# Altium schematic sheet PIJIAKUN_BF83080C_V1.0-260104-共阳_20260721.schdoc
size 297 x 209 mm; Symbol: Drawing-Symbol_A4; Company: 嘉立创EDA; Version: V1.0; Page Size: A4; @Project Name: 20270715_PIJIAKUN; @Update Date: 2026-07-20; @Create Date: 2026-07-20; Device: Drawing-Symbol_A4; @Board Name: Board3; @Page Name: P1; @Create Time: 16:21:44; @Page Count: 1; @Page No: 1; @Schematic Name: Schematic2; @Update Time: 16:21:44; @Assembly Variant: Basic; Border: 1; Title Block Position: 3; Size: A4; Width: 1170; Height: 825; Region Start: 1; X Region Count: 6; Y Region Count: 4; Blade Width: 10
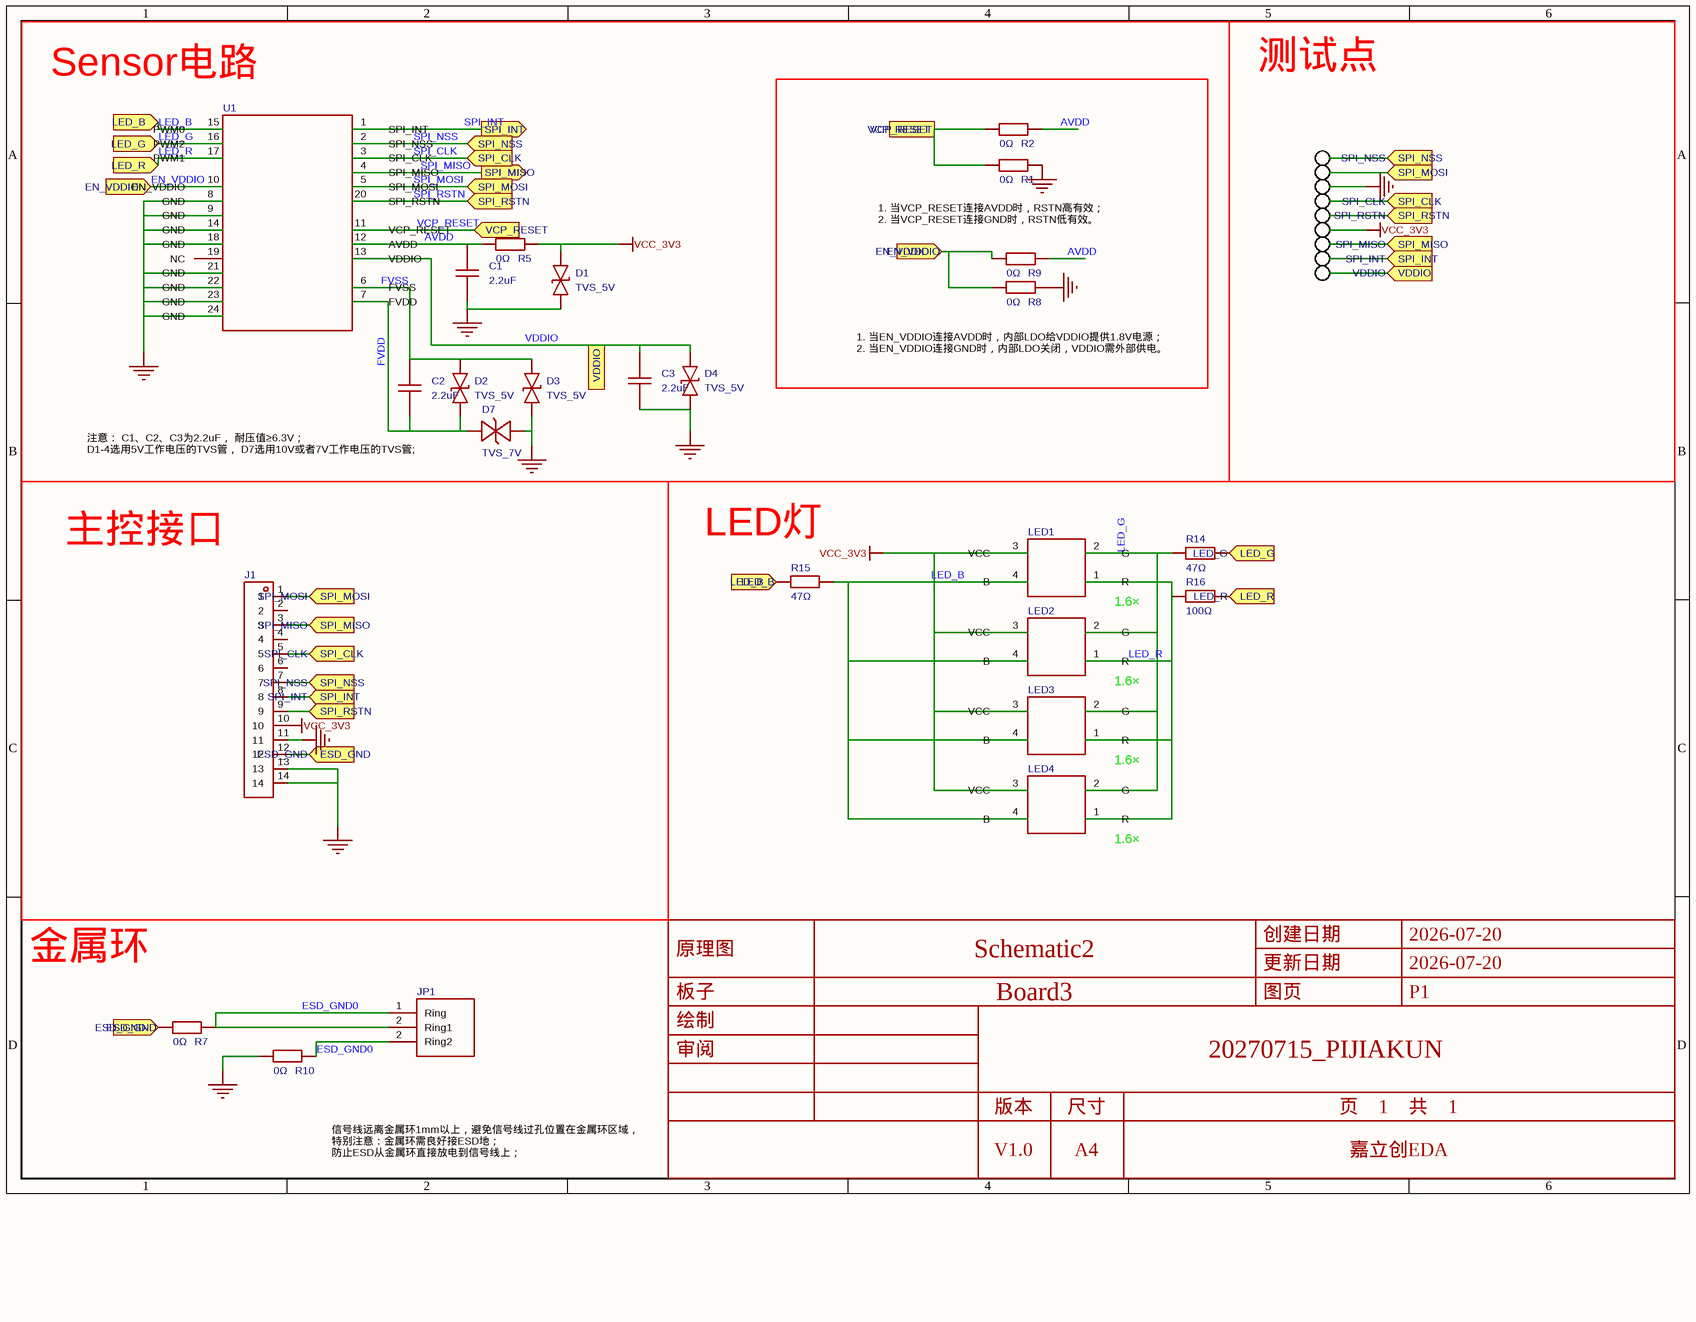
[diagram p0: PIJIAKUN_BF83080C_V1.0-260104-共阳_20260721.schdoc]

## Parts
C1  2.2uF  [C0402]
C2  2.2uF  [C0402]
C3  2.2uF  [C0402]
D1  TVS_5V  [X1-DFN1006-2_L1.0-W0.6-P0.65-BI]
D2  TVS_5V  [X1-DFN1006-2_L1.0-W0.6-P0.65-BI]
D3  TVS_5V  [X1-DFN1006-2_L1.0-W0.6-P0.65-BI]
D4  TVS_5V  [X1-DFN1006-2_L1.0-W0.6-P0.65-BI]
D7  TVS_7V  [X1-DFN1006-2_L1.0-W0.6-P0.65-BI]
J1  KH-1.27FH-1X14P-H4.3  [FPC-SMD_12P-P0.50_L10.7-W5.3]  (value not drawn)
JP1  (no value)  [Metal_Ring_16.65mm]
LED1  (no value)  [LED-SMD_4P-L1.6-W1.5-TL-A]
LED2  (no value)  [LED-SMD_4P-L1.6-W1.5-TL-A]
LED3  (no value)  [LED-SMD_4P-L1.6-W1.5-TL-A]
LED4  (no value)  [LED-SMD_4P-L1.6-W1.5-TL-A]
R1  0Ω  [R0402]
R2  0Ω  [R0402]
R5  0Ω  [R0402]
R7  0Ω  [R0402]
R8  0Ω  [R0402]
R9  0Ω  [R0402]
R10  0Ω  [R0402]
R14  47Ω  [R0402]
R15  47Ω  [R0402]
R16  100Ω  [R0402]
U1  (no value)  [BF83080C_4_FP]

## Blocks framed on the sheet
Sensor电路: C1-C3 D1-D4 D7 R1 R2 R5 R8 R9 U1
主控接口: J1
金属环: JP1 R7 R10

## Ports
EN_VDDIO (in), ESD_GND (in), LED_B (in), LED_G (in), LED_R (in), SPI_CLK (in), SPI_INT (in), SPI_INT (out), SPI_MISO (in), SPI_MISO (out), SPI_MOSI (in), SPI_NSS (in), SPI_RSTN (in), VCP_RESET (in), VDDIO (in)

## Nets
GND: C1.1 C3.1 D1.1 D3.1 D4.1 D7.2 J1.11 J1.13 J1.14 R1.2 R8.2 R10.1 U1.8(GND) U1.9(GND) U1.14(GND) U1.18(GND) U1.21(GND) U1.22(GND) U1.23(GND) U1.24(GND)
VCC_3V3: D1.2 J1.10 LED1.3(VCC) LED2.3(VCC) LED3.3(VCC) LED4.3(VCC) R5.2
AVDD: C1.2 R2.2 R5.1 R9.2 U1.12(AVDD)
EN_VDDIO: R8.1 R9.1 U1.10(EN_VDDIO) ; port EN_VDDIO
ESD_GND: J1.12 R7.1 ; port ESD_GND
ESD_GND0: JP1.1(Ring) JP1.2(Ring1) R7.2 R10.2
FVDD: C2.1 D2.1 D7.1 U1.7(FVDD)
FVSS: C2.2 D2.2 D3.2 U1.6(FVSS)
LED_B: LED1.4(B) LED2.4(B) LED3.4(B) LED4.4(B) R15.1 R15.2 U1.15(PWM0) ; port LED_B
LED_G: LED1.2(G) LED2.2(G) LED3.2(G) LED4.2(G) R14.1 R14.2 U1.16(PWM2) ; port LED_G
LED_R: LED1.1(R) LED2.1(R) LED3.1(R) LED4.1(R) R16.1 R16.2 U1.17(PWM1) ; port LED_R
SPI_CLK: J1.5 U1.3(SPI_CLK) ; port SPI_CLK
SPI_INT: J1.8 U1.1(SPI_INT) ; port SPI_INT
SPI_MISO: J1.3 U1.4(SPI_MISO) ; port SPI_MISO
SPI_MOSI: J1.1 U1.5(SPI_MOSI) ; port SPI_MOSI
SPI_NSS: J1.7 U1.2(SPI_NSS) ; port SPI_NSS
SPI_RSTN: J1.9 U1.20(SPI_RSTN) ; port SPI_RSTN
VCP_RESET: R1.1 R2.1 U1.11(VCP_RESET) ; port VCP_RESET
VDDIO: C3.2 D4.2 U1.13(VDDIO) ; port VDDIO

Not connected (* = marked no-connect by the designer): J1 2 4 6; U1 19(NC)

## Notes on the sheet
- 测试点
- 1. 当VCP_RESET连接AVDD时，RSTN高有效；
  2. 当VCP_RESET连接GND时，RSTN低有效。
- 1. 当EN_VDDIO连接AVDD时，内部LDO给VDDIO提供1.8V电源；
  2. 当EN_VDDIO连接GND时，内部LDO关闭，VDDIO需外部供电。
- (near J1) 注意： C1、C2、C3为2.2uF， 耐压值≥6.3V；
  D1-4选用5V工作电压的TVS管， D7选用10V或者7V工作电压的TVS管;
- (near R15) LED灯
- 信号线远离金属环1mm以上，避免信号线过孔位置在金属环区域，
  特别注意：金属环需良好接ESD地；
  防止ESD从金属环直接放电到信号线上；
- 创建日期
- 2026-07-20
- 原理图
- 板子
- Schematic2
- Board3
- 更新日期
- 图页
- P1
- 绘制
- 审阅
- 20270715_PIJIAKUN
- 版本
- V1.0
- 尺寸
- A4
- 页    1    共    1
- 嘉立创EDA

## Library data of the parts
C1-C3 = GRM155R61C225ME15D: 容值:2.2uF;精度:±20%;额定电压:16V;温度系数:-;; Manufacturer: muRata(村田); 3D Model: 36a51122f27c49738f86b3bfa98863e00819f05c4eef4c71ace90d822a990e87; 3D Model Transform: 39.37,19.685,0,0,0,0,0,0,0; Tolerance: ±20%; Voltage Rating: 16V; AddInBom: yes; ModelName: C0402_L1.0-W0.5-H0.5; Symbol: GRM155R61C225ME15D; Device: GRM155R61C225ME15D; LCSC Part Name: 2.2uF ±20% 16V; Supplier Part: C710876; Manufacturer Part: GRM155R61C225ME15D; Supplier Footprint: 0402; JLCPCB Part Class: Extended Part; Datasheet: https://atta.szlcsc.com/upload/public/pdf/source/20210420/C710876_034B19F0B568C7645EEC87938904C096.pdf; Supplier: LCSC; Value: 2.2uF; Temperature Coefficient: -; ConvertToPcb: yes; FootprintName: C0402
D1 D2 D4 = RSD6368FT: 3D Model: e1a2843302f940e8ac07b7d637792d480819f05c4eef4c71ace90d822a990e87; 3D Model Transform: 39.37,23.622,0,0,0,0,0,0,0; AddInBom: yes; Symbol: RSD6368FT; Device: RSD6368FT; LCSC Part Name: RSD6368FT; Supplier Part: C9900013416; Manufacturer Part: RSD6368FT; Supplier Footprint: X1-DFN1006-2; JLCPCB Part Class: Extended Part; Supplier: LCSC; ConvertToPcb: yes; FootprintName: X1-DFN1006-2_L1.0-W0.6-P0.65-BI; ModelName: X1-DFN1006-2_L1.0-W0.6-P0.65-BI
D3 = RSD6368FT: Convert to PCB: yes; 3D Model: e1a2843302f940e8ac07b7d637792d480819f05c4eef4c71ace90d822a990e87; 3D Model Transform: 39.37,23.622,0,0,0,0,0,0,0; Symbol: RSD6368FT; Device: RSD6368FT; LCSC Part Name: RSD6368FT; Supplier Part: C9900013416; Manufacturer Part: RSD6368FT; Supplier Footprint: X1-DFN1006-2; JLCPCB Part Class: Extended Part; Supplier: LCSC; AddInBom: yes; FootprintName: X1-DFN1006-2_L1.0-W0.6-P0.65-BI; ModelName: X1-DFN1006-2_L1.0-W0.6-P0.65-BI
D7 = RSCD5T6MB: 3D Model: e1a2843302f940e8ac07b7d637792d480819f05c4eef4c71ace90d822a990e87; 3D Model Transform: 39.37,23.622,0,0,0,0,0,0,0; AddInBom: yes; Symbol: RSCD5T6MB; Device: RSCD5T6MB; Manufacturer Part: TVS_7V; LCSC Part Name: RSCD5T6MB; Supplier Part: C9900013419; Supplier Footprint: X1-DFN1006-2; JLCPCB Part Class: Extended Part; Supplier: LCSC; ConvertToPcb: yes; FootprintName: X1-DFN1006-2_L1.0-W0.6-P0.65-BI; ModelName: X1-DFN1006-2_L1.0-W0.6-P0.65-BI
J1 = KH-1.27FH-1X14P-H4.3: 插孔结构:1x14P;间距:1.27mm;行距:-;圆孔/方孔:方孔;安装方式:直插;排数:单排;总孔位数:14P;额定电流:1A;额定电压:-;插孔方向:顶部;塑高:4.3mm;工作温度:-40℃~+105℃;; Manufacturer: kinghelm(金航标); 3D Model: 7370ad25492944a4963b69ea6a5db6c50819f05c4eef4c71ace90d822a990e87; 3D Model Transform: 715.7466,82.677,0,0,0,0,0,0,-94.488; Holes Structure: 1x14P; Pitch: 1.27mm; Circular Hole / Square Hole: 方孔; Number of Positions: 14P; Current Rating: 1A; Holes Direction: 顶部; AddInBom: yes; ModelName: CONN-TH_14P-P1.27_KINGHELM_KH-1.27FH-1X14P-H4.3; Symbol: KH-1.27FH-1X14P-H4.3; Device: KH-1.27FH-1X14P-H4.3; LCSC Part Name: 间距:1.27mm 1x14P 直插; Supplier Part: C2938386; Manufacturer Part: KH-1.27FH-1X14P-H4.3; Supplier Footprint: 插件,P=1.27mm; JLCPCB Part Class: Extended Part; Datasheet: https://item.szlcsc.com/datasheet/KH-1.27FH-1X14P-H4.3/3294766.html; Supplier: LCSC; Row Spacing: -; Mounting Type: 直插; Number of Rows: 单排; Voltage Rating (Max): -; Insulation Height: 4.3mm; Operating Temperature: -40℃~+105℃; ConvertToPcb: yes; FootprintName: FPC-SMD_12P-P0.50_L10.7-W5.3
JP1 = Ring_PAD: Add into BOM: yes; Symbol: Ring_PAD; Device: Ring_PAD; Convert to PCB: yes; FootprintName: Metal_Ring_16.65mm
LED1-LED4 = 0603 贴片型三色LED: 1.6×; AddInBom: yes; Symbol: 0603 贴片型三色LED; Device: 0603 贴片型三色LED; FootprintName: LED-SMD_4P-L1.6-W1.5-TL-A; ConvertToPcb: yes
R1 R2 R5 R7-R10 = RC0402JR-070RL: 电阻类型:厚膜电阻;阻值:0Ω;精度:±5%;功率:62.5mW;工作电压:50V;温度系数:-;; Manufacturer: YAGEO(国巨); 3D Model: 98c88bc2b9094f218f3a3e30a70127380819f05c4eef4c71ace90d822a990e87; 3D Model Transform: 39.37,19.685,0,0,0,0,0,0,0; Tolerance: ±5%; Power(Watts): 62.5mW; Voltage-Supply(Max): 50V; AddInBom: yes; ModelName: R0402_L1.0-W0.5-H0.4; Symbol: RC0402JR-070RL; Device: RC0402JR-070RL; LCSC Part Name: 厚膜电阻 0Ω ±5% 62.5mW; Supplier Part: C60485; Manufacturer Part: RC0402JR-070RL; Supplier Footprint: 0402; JLCPCB Part Class: Extended Part; Datasheet: https://item.szlcsc.com/datasheet/RC0402JR-070RL/61537.html; Supplier: LCSC; Type: 厚膜电阻; Value: 0Ω; Temperature Coefficient: -; Operating Temperature: -55℃~+155℃; ConvertToPcb: yes; FootprintName: R0402
R14-R16 = RC0402JR-0747RL: 电阻类型:厚膜电阻;阻值:47Ω;精度:±5%;功率:62.5mW;最大工作电压:50V;温度系数:±100ppm/℃;; Manufacturer: YAGEO(国巨); 3D Model: 98c88bc2b9094f218f3a3e30a70127380819f05c4eef4c71ace90d822a990e87; 3D Model Transform: 39.37,19.685,0,0,0,0,0,0,0; Tolerance: ±5%; Power(Watts): 62.5mW; Overload Voltage (Max): 50V; AddInBom: yes; ModelName: R0402_L1.0-W0.5-H0.4; Symbol: RC0402JR-0747RL; Device: RC0402JR-0747RL; LCSC Part Name: 厚膜电阻 47Ω ±5% 62.5mW; Manufacturer Part: RC0402JR-0747RL; Supplier Footprint: 0402; JLCPCB Part Class: Extended Part; Datasheet: https://atta.szlcsc.com/upload/public/pdf/source/20181009/C309620_DA5935B6E1D48212CB7A533FE518B3C2.pdf; Supplier: LCSC; Type: 厚膜电阻; Temperature Coefficient: ±100ppm/℃; Operating Temperature Range: -55℃~+155℃; ConvertToPcb: yes; FootprintName: R0402
  R14 R15: Supplier Part: C137864; Value: 47Ω
  R16: Value: 100Ω
U1 = BF83080C_4: Add into BOM: yes; Symbol: BF83080C_4; Device: BF83080C_4; Convert to PCB: yes